# EAGLE design Dhuma (EAGLE 9.6.0)
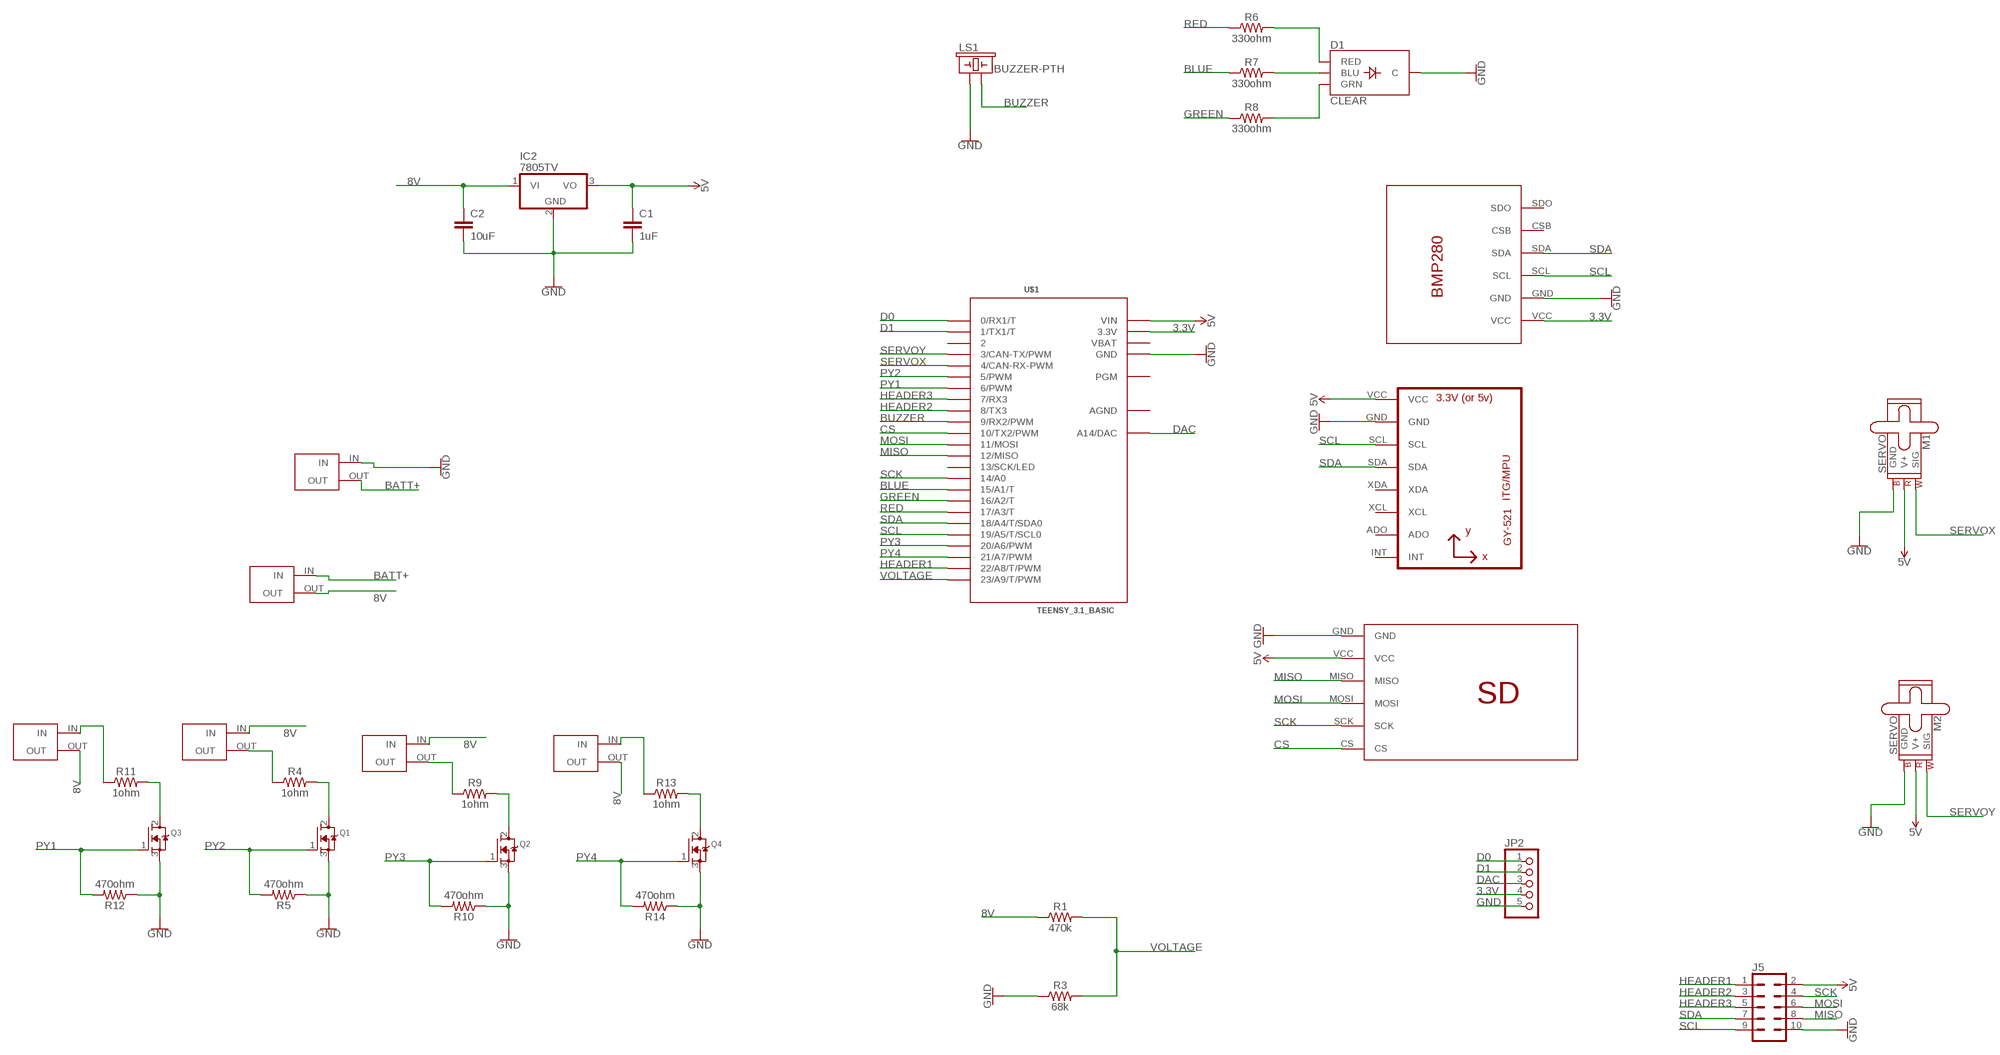
[diagram p0: schematic, sheet 1]

## Parts
C1  1uF  22PF-PTH-2.54MM-200V-5%  [CAP-PTH-2.54]
C2  10uF  22PF-PTH-2.54MM-200V-5%  [CAP-PTH-2.54]
D1  CLEAR  LED-RGB-CCCLEAR  [LED-RGB-THRU]
IC2  7805TV  [TO220V]
J5  CONN_05X2NO_SILK  [2X5_NOSILK]
JP2  PINHD-1X5  [1X05]
LS1  BUZZER-PTH  [BUZZER-12MM]
M1  SERVO  [1X03]
M2  SERVO  [1X03]
Q1  MOSFET-NGDS_TO220V  [TO220V]
Q2  MOSFET-NGDS_TO220V  [TO220V]
Q3  MOSFET-NGDS_TO220V  [TO220V]
Q4  MOSFET-NGDS_TO220V  [TO220V]
R1  470k  10OHM-HORIZ-1/4W-1%  [AXIAL-0.3]
R3  68k  10OHM-HORIZ-1/4W-1%  [AXIAL-0.3]
R4  1ohm  10OHM-HORIZ-1/4W-1%  [AXIAL-0.3]
R5  470ohm  10OHM-HORIZ-1/4W-1%  [AXIAL-0.3]
R6  330ohm  10OHM-HORIZ-1/4W-1%  [AXIAL-0.3]
R7  330ohm  10OHM-HORIZ-1/4W-1%  [AXIAL-0.3]
R8  330ohm  10OHM-HORIZ-1/4W-1%  [AXIAL-0.3]
R9  1ohm  10OHM-HORIZ-1/4W-1%  [AXIAL-0.3]
R10  470ohm  10OHM-HORIZ-1/4W-1%  [AXIAL-0.3]
R11  1ohm  10OHM-HORIZ-1/4W-1%  [AXIAL-0.3]
R12  470ohm  10OHM-HORIZ-1/4W-1%  [AXIAL-0.3]
R13  1ohm  10OHM-HORIZ-1/4W-1%  [AXIAL-0.3]
R14  470ohm  10OHM-HORIZ-1/4W-1%  [AXIAL-0.3]
U1  GY-521MPU6050  [GY-521]
U$1  TEENSY_3.1_BASIC  [TEENSY_3.1_BASIC]
U$2  BMP280  [BMP280]
U$3  SDCARD  [SDCARD]
U$4  TERMINALBLOCKUP  [TERMINALBLOCKUP]
U$5  TERMINALBLOCKUP  [TERMINALBLOCKUP]
U$6  TERMINALBLOCKUP  [TERMINALBLOCKUP]
U$7  TERMINALBLOCKUP  [TERMINALBLOCKUP]
U$8  TERMINALBLOCKUP  [TERMINALBLOCKUP]
U$9  TERMINALBLOCKUP  [TERMINALBLOCKUP]

## Nets
3.3V: JP2.4 U$1.3.3V U$1.3.3V1(3.3V) U$2.VCC
5V: C1.1 IC2.3(VO) J5.2 M1.2(V+) M2.2(V+) U1.VCC U$1.VIN U$3.VCC
8V: C2.1 IC2.1(VI) R1.P$1 U$4.IN U$5.OUT U$6.IN U$7.OUT U$9.OUT
BATT+: U$8.OUT U$9.IN
BLUE: R7.P$1 U$1.15/A1(15/A1/T)
BUZZER: LS1.- U$1.9(9/RX2/PWM)
CS: U$1.10(10/TX2/PWM) U$3.CS
D0: JP2.1 U$1.0(0/RX1/T)
D1: JP2.2 U$1.1(1/TX1/T)
DAC: JP2.3 U$1.A14(A14/DAC)
GND: C1.2 C2.2 D1.2(C) IC2.2(GND) J5.10 JP2.5 LS1.+ M1.3(GND) M2.3(GND) Q1.3(S) Q2.3(S) Q3.3(S) Q4.3(S) R3.P$1 R5.P$1 R10.P$1 R12.P$1 R14.P$1 U1.GND U$1.GND U$1.GND1(GND) U$2.GND U$3.GND U$8.IN
GREEN: R8.P$1 U$1.16/A2(16/A2/T)
HEADER1: J5.1 U$1.22/A8(22/A8/T/PWM)
HEADER2: J5.3 U$1.8(8/TX3)
HEADER3: J5.5 U$1.7(7/RX3)
MISO: J5.8 U$1.12(12/MISO) U$3.MISO
MOSI: J5.6 U$1.11(11/MOSI) U$3.MOSI
N$1: D1.1(RED) R6.P$2
N$2: D1.3(GRN) R8.P$2
N$3: D1.4(BLU) R7.P$2
N$4: Q1.2(D) R4.P$2
N$6: R11.P$1 U$5.IN
N$7: R4.P$1 U$4.OUT
N$8: Q2.2(D) R9.P$2
N$9: R13.P$1 U$7.IN
N$10: R9.P$1 U$6.OUT
N$11: Q3.2(D) R11.P$2
N$14: Q4.2(D) R13.P$2
PY1: Q3.1(G) R12.P$2 U$1.6(6/PWM)
PY2: Q1.1(G) R5.P$2 U$1.5(5/PWM)
PY3: Q2.1(G) R10.P$2 U$1.20/A6(20/A6/PWM)
PY4: Q4.1(G) R14.P$2 U$1.21/A7(21/A7/PWM)
RED: R6.P$1 U$1.17/A3(17/A3/T)
SCK: J5.4 U$1.14/A0 U$3.SCK
SCL: J5.9 U1.SCL U$1.19/A5(19/A5/T/SCL0) U$2.SCL
SDA: J5.7 U1.SDA U$1.18/A4(18/A4/T/SDA0) U$2.SDA
SERVOX: M1.1(SIG) U$1.4(4/CAN-RX-PWM)
SERVOY: M2.1(SIG) U$1.3(3/CAN-TX/PWM)
VOLTAGE: R1.P$2 R3.P$2 U$1.23/A9(23/A9/T/PWM)
Unconnected: U1.ADO U1.INT U1.XCL U1.XDA U$1.2 U$1.13(13/SCK/LED) U$1.PGM U$2.CSB U$2.SDO

## Power pins joined to a net without a drawn wire
AGND: U$1.AGND
VBAT: U$1.VBAT

## Library data of the parts
C1 C2 = SparkFun-Capacitors:22PF: 22pF ceramic capacitors A capacitor is a passive two-terminal electrical component used to store electrical energy temporarily in an electric field.; PROD_ID: CAP-09128; VALUE: 22pF
D1 = SparkFun-LED:LED-RGB-CC: LED-RGB Common Cathode Packages: LED RGB-THRU LED_PIRANHA_5MM SparkFun Products: RGB Diffused Common Cathode- Diffuse <[https://www.sparkfun.com/products/9264]> RGB Diffused Common Cathode - Clear <[https://www.sparkfun.com/products/105]> LED-RGB 5mm Square (Piranha) <[https://www.sparkfun.com/products/11679]>; PROD_ID: DIO-08418
IC2 = linear:78*: Positive VOLTAGE REGULATOR Source: http://cache.national.com/ds/LM/LM78L05.pdf http://www.fairchildsemi.com/ds/LM/LM7805.pdf
J5 = SparkFun-Connectors:CONN_05X2: Multi connection point. Often used as Generic Header-pin footprint for 0.1 inch spaced/style header connections For AVR SPI programming port, see special device with nice symbol: "AVR_SPI_PROG_5x2.dev" You can populate with any combo of single row headers, but if you'd like an exact match, check these: 2x5 AVR ICSP Male Header <https://www.sparkfun.com/products/778> (PRT-00778) 2x5 Pin Shrouded Header <https://www.sparkfun.com/products/8506> (PRT-08506) On any of the 0.1 inch spaced packages, you can populate with these: Break Away Headers - Straight <https://www.sparkfun.com/products/116> (PRT-00116) Break Away Male Headers - Right Angle <https://www.sparkfun.com/products/553> (PRT-00553) Female Headers <https://www.sparkfun.com/products/115> (PRT-00115) Break Away Headers - Machine Pin <https://www.sparkfun.com/products/117> (PRT-00117) Break Away Female Headers - Swiss Machine Pin <https://www.sparkfun.com/products/743> (PRT-00743) Special note: the shrouded connector mates well with our 5x2 ribbon cables: 2x5 Pin IDC Ribbon Cable <https://www.sparkfun.com/products/8535> (PRT-08535)
JP2 = pinhead:PINHD-1X5: PIN HEADER
LS1 = SparkFun-Electromechanical:BUZZER: Buzzer Small round buzzers that operate around the audible 2kHz range. You can use these as speakers to create simple music or user interfaces. Variant Overview: PTH - Mini Speaker - PC Mount 12mm 2.048kHz <https://www.sparkfun.com/products/7950> PTH_KIT - Mini Speaker - PC Mount 12mm 2.048kHz <https://www.sparkfun.com/products/7950> KIT simplifies soldering by adding stop mask to one side of the pads. PTH_NO_SILK - Mini Speaker - PC Mount 12mm 2.048kHz <https://www.sparkfun.com/products/7950> No silkscreen indicator of buzzer outline. PTH_KIT_NO_SILK - Mini Speaker - PC Mount 12mm 2.048kHz <https://www.sparkfun.com/products/7950> KIT package w/o silkscreen SMD - Buzzer Audio Magnetic (CCV-084B16) SMD buzzer used on, e.g. the LilyPad Buzzer <https://www.sparkfun.com/products/8463> and RFID USB Reader <https://www.sparkfun.com/products/9963>. SMD_KIT - Buzzer Audio Magnetic (CCV-084B16) SMD Buzzer with elongated pins to make soldering easier. Used on the SparkFun Simon Says - Surface Mount Soldering Kit <https://www.sparkfun.com/products/10935>.; PROD_ID: COMP-08253; SF_SKU: COM-07950
M1 M2 = SparkFun-Electromechanical:SERVO: Servo Motor 3-pin connector for a standard servo motor (voltage supply, ground, and control signal.) SparkFun Products Servo - Generic (Sub-Micro Size) <https://www.sparkfun.com/products/9065> (ROB-09065) Servo - Generic High Torque Continuous Rotation (Standard Size) <https://www.sparkfun.com/products/9347> (ROB-09347) Servo - Generic High Torque (Standard Size) <https://www.sparkfun.com/products/11965> (ROB-11965)
Q1-Q4 = adafruit:MOSFET-N: N-Channel Mosfet 2N7002E - 60V 260mA SOT23 [Digikey: 2N7002ET1GOSTR-ND] - REEL BSH103 - 30V 850mA SOT23 [Digikey: 568-5013-1-ND]
R1 R3-R14 = SparkFun-Resistors:10OHM: 10Ω resistor A resistor is a passive two-terminal electrical component that implements electrical resistance as a circuit element. Resistors act to reduce current flow, and, at the same time, act to lower voltage levels within circuits. - Wikipedia; PROD_ID: RES-12180; VALUE: 10
U1 = gy-521:GY-521
U$1 = Teensy_3_Series_Board_v1.0:TEENSY_3.1_BASIC: Footprint for Teensy 3.1 board using all pin connections on the outer perimeter
U$2 = bmp280:BMP280
U$3 = SDCARD:SDCARD
U$4-U$9 = Terminal:TERMINALBLOCKUP

## Board
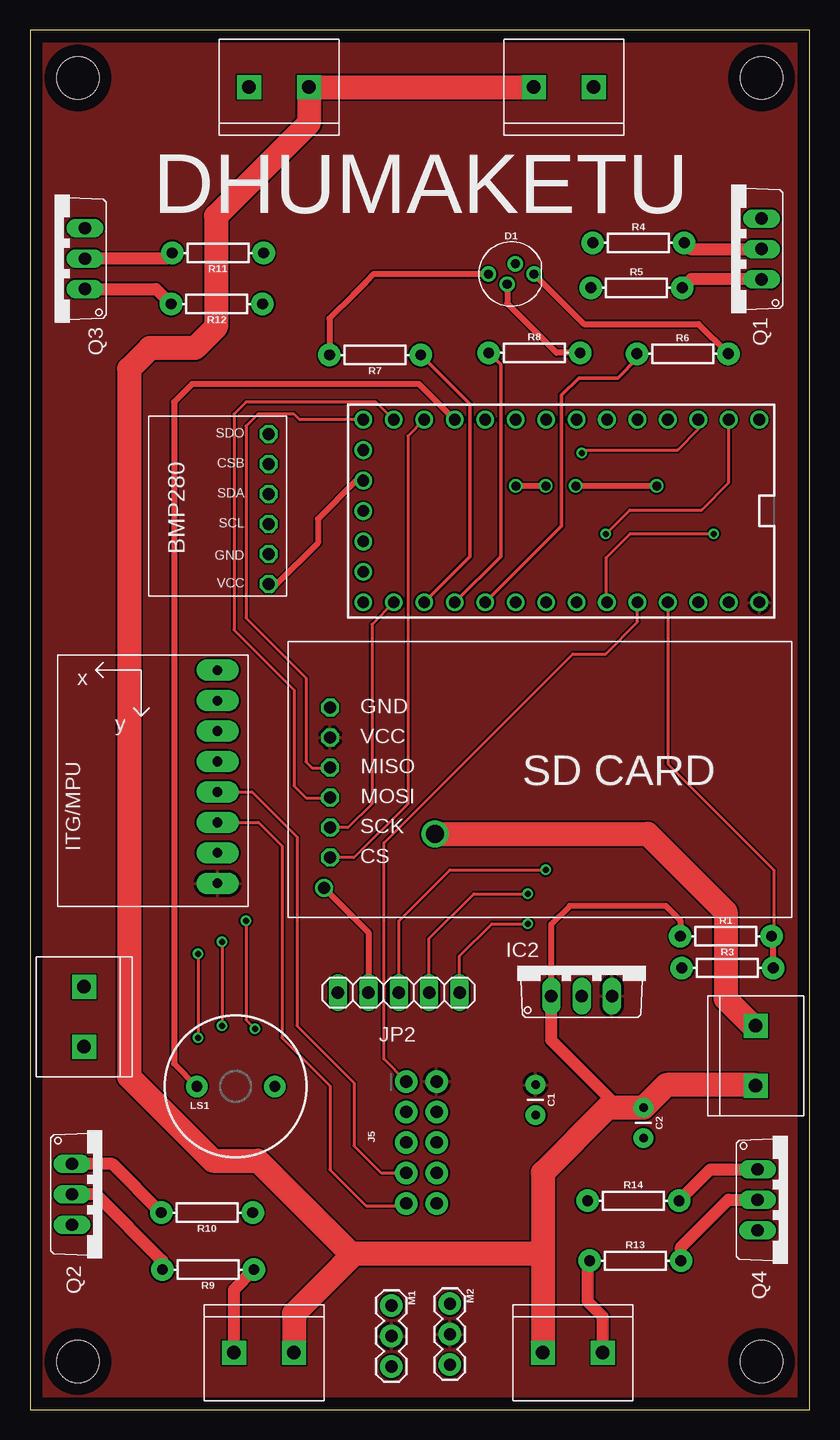
[diagram p1: board, top side]
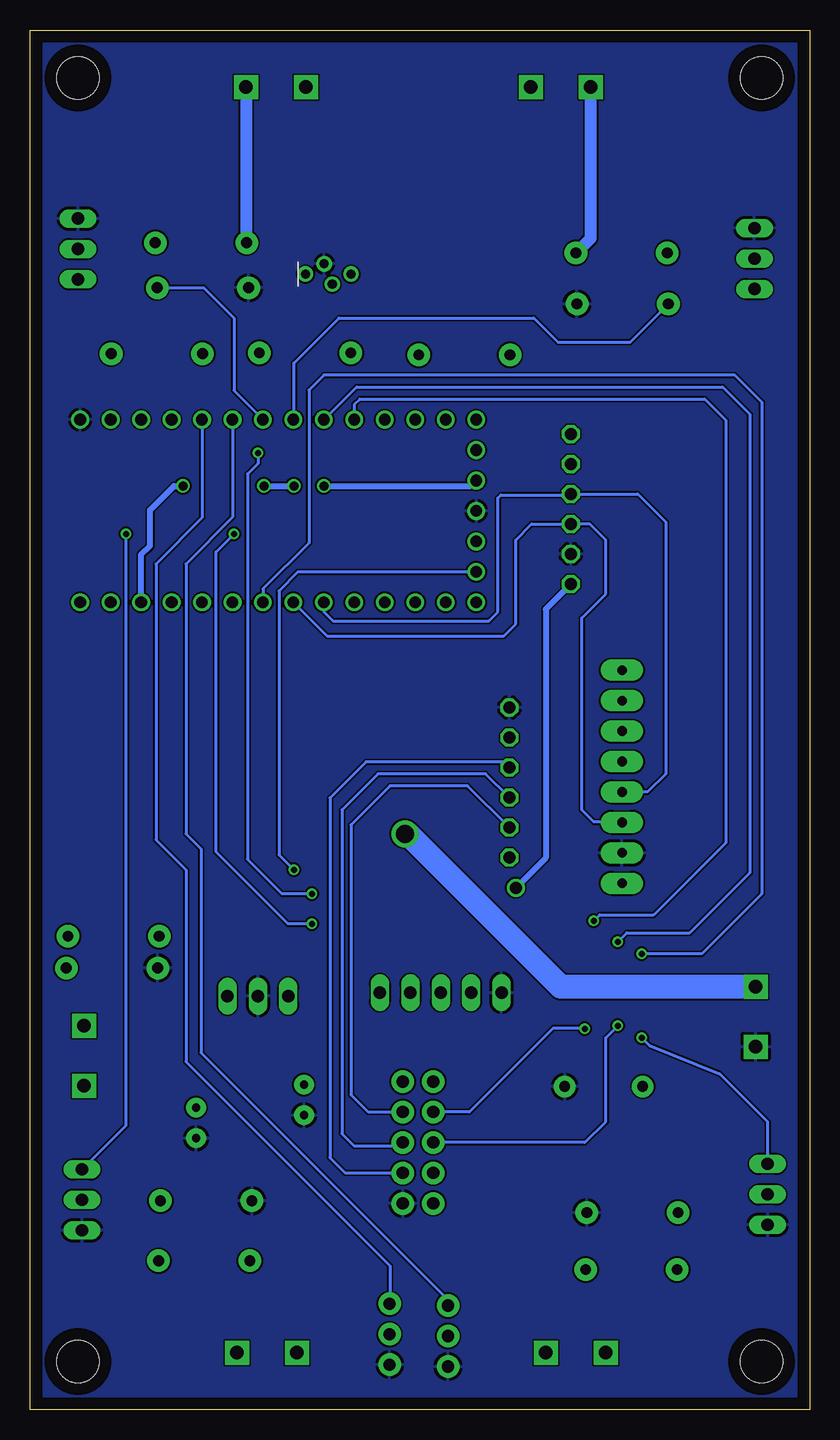
[diagram p2: board, bottom side, seen from below]

Size 65 x 115 mm. Coordinates in mm from the lower left corner, seen from the top.
Outline: 0,0 65,0 65,115 0,115 0,0
Copper layers (1*16): Top 0.035mm / dielectric 1.5mm / Bottom 0.035mm
Design rules "default": minimum track width 6mil, minimum drill 0.35mm, track to track 6mil, track to pad 6mil, pad to pad 6mil, via to via 6mil, smd to smd 6mil, copper to edge 40mil, drill to drill 6mil, minimum pad ring 10mil, minimum via ring 8mil, stop-mask expansion 4mil, vias tented up to drill 0mil, thermal gap 10mil
Holes 3.5 mm at 4,4 61,4 61,111 4,111

### Footprints (pad centres in the part's own frame; a part is rotated, then mirrored left to right if it is on the bottom)
CAP-PTH-2.54 = drill 0.7 pad 1.651: 1 -1.27,0; 2 1.27,0
LED-RGB-THRU = drill 0.762 pad 1.27: 1 1.905,0; 2 0.335,0.85; 3 -0.335,-0.85; 4 -1.905,0
TO220V = drill 1.016 long: 1 -2.54,-2.54; 2 0,-2.54; 3 2.54,-2.54
2X5_NOSILK = drill 1.016 pad 1.88: 1 0,0; 2 0,2.54; 3 2.54,0; 4 2.54,2.54; 5 5.08,0; 6 5.08,2.54; 7 7.62,0; 8 7.62,2.54; 9 10.16,0; 10 10.16,2.54
1X05 = drill 1.016 long: 1 -5.08,0; 2 -2.54,0; 3 0,0; 4 2.54,0; 5 5.08,0
BUZZER-12MM = drill 0.9 pad 1.778: + 3.25,0; - -3.25,0
1X03 = drill 1.016 pad 1.88: 1 0,0; 2 2.54,0; 3 5.08,0
AXIAL-0.3 = drill 0.9 pad 1.88: P$1 -3.81,0; P$2 3.81,0
GY-521 = drill 0.8 pad 1.778 long: ADO -8.89,-6.35; GND -8.89,6.35; INT -8.89,-8.89; SCL -8.89,3.81; SDA -8.89,1.27; VCC -8.89,8.89; XCL -8.89,-3.81; XDA -8.89,-1.27
TEENSY_3.1_BASIC = drill 0.965: 0 -7.62,13.97; 1 -7.62,11.43; 2 -7.62,8.89; 3 -7.62,6.35; 3.3V 7.62,11.43; 3.3V1 -2.54,-16.51; 4 -7.62,3.81; 5 -7.62,1.27; 6 -7.62,-1.27; 7 -7.62,-3.81; 8 -7.62,-6.35; 9 -7.62,-8.89; 10 -7.62,-11.43; 11 -7.62,-13.97; 12 -7.62,-16.51; 13 7.62,-16.51; 14/A0 7.62,-13.97; 15/A1 7.62,-11.43; 16/A2 7.62,-8.89; 17/A3 7.62,-6.35; 18/A4 7.62,-3.81; 19/A5 7.62,-1.27; 20/A6 7.62,1.27; 21/A7 7.62,3.81; 22/A8 7.62,6.35; 23/A9 7.62,8.89; A14 5.08,-16.51; AGND 7.62,13.97; GND -7.62,16.51; GND1 0,-16.51; PGM 2.54,-16.51; VBAT -5.08,-16.51; VIN 7.62,16.51
BMP280 = drill 1 octagon: CSB 11,1.5; GND 3.5,1.5; SCL 6,1.5; SDA 8.5,1.5; SDO 13.5,1.5; VCC 1,1.5
SDCARD = drill 1 octagon: CS 3.5,5; GND 3.5,17.5; MISO 3.5,12.5; MOSI 3.5,10; SCK 3.5,7.5; VCC 3.5,15
TERMINALBLOCKUP = drill 1.1 pad 2 square: IN 2.5,4; OUT 7.5,4

### Placement (x,y rotation side)
C1  42.15,25.81 270 top
C2  51.15,23.89 270 top
D1  40.13,94.66 0 top
IC2  46,37 0 top
J5  31.37,27.34 270 top
JP2  30.75,34.75 180 top
LS1  17.16,26.93 0 top
M1  30.14,8.66 270 top
M2  35.01,8.82 270 top
Q1  58.46,96.75 90 top
Q2  6.04,17.93 270 top
Q3  2.05,95.95 90 top
Q4  63.2,17.48 270 top
R1  58.03,39.45 0 top
R3  58.16,36.81 0 top
R4  50.74,97.26 0 top
R5  50.58,93.51 0 top
R6  54.42,88.01 0 top
R7  28.78,87.91 180 top
R8  42.06,88.09 0 top
R9  14.85,11.66 180 top
R10  14.76,16.41 180 top
R11  15.67,96.41 180 top
R12  15.58,92.16 180 top
R13  50.47,12.4 0 top
R14  50.31,17.4 0 top
U1  6.75,52.75 180 top
U$1  44.3,74.9 270 top
U$2  21.4,67.82 90 top
U$3  21.53,41.02 0 top
U$4  39.5,106.25 0 top
U$5  15.75,106.25 0 top
U$6  24.5,8.75 180 top
U$7  50.25,8.75 180 top
U$8  8.5,27.75 90 top
U$9  56.5,34.5 270 top

### Tracks (layer width: path | path; a pad name or v marks a point on that pad's centre or on a via)
3.3V  (via drill 0.75, 1)
  Top 0.5: U$1.3.3V1 27.19,77.44 24,74.25 24,72.25 20.57,68.82 U$2.VCC | v52.25,77 v45.5,77 | v43,77 v40.5,77 | v24.5,43.5 28.21,39.79 JP2.4
  Bottom 0.5: U$2.VCC 22,66.72 22,46 v24.5,43.5 | U$1.3.3V 55.73,71.27 55,72 55,75 53,77 v52.25,77 | v45.5,77 v43,77 | v40.5,77 28.23,77 U$1.3.3V1
5V
  pour Top: -2,117 67,117 67,-2 -2,-2
8V
  Top 0.5: IC2.1 43.46,40.46 45,42 53,42 54.22,40.78 R1.P$1
  Top 1: C2.1 49.09,25.16 43.46,30.79 IC2.1
  Top 2: U$9.OUT 60.44,27.06 53.05,27.06 C2.1 48.16,25.16 42.75,19.75 42.75,13 | 42.75,13 U$7.OUT | U$4.IN U$5.OUT 23.25,107.25 15.5,99.5 15.5,90.25 13.75,88.5 10,88.5 8.25,86.75 8.25,27.75 15.25,20.75 19,20.75 26.88,12.88 | 42.75,13 27,13 26.88,12.88 | 26.88,12.88 26,12 22,8 U$6.IN
BATT+  (via drill 1.5)
  Top 2: v33.75,48 51.5,48 58,41.5 58,34.25 60.25,32 U$9.IN
  Bottom 2: U$8.OUT 20.75,35.25 33.5,48 v33.75,48
BLUE
  Top 0.3: R7.P$1 36.7,83.8 36.7,71.11 U$1.15/A1
BUZZER
  Top 0.5: U$1.9 32.43,85.5 13.5,85.5 12,84 12,28.84 LS1.-
CS
  Top 0.25: U$1.10 31.5,81.15 31.5,50.5 27.02,46.02 U$3.CS
D0  (via drill 0.5)
  Top 0.25: JP2.1 35.83,37.83 38.5,40.5 v41.5,40.5 | v48,73 50,75 56,75 58.27,77.27 U$1.0
  Bottom 0.25: v41.5,40.5 43.5,40.5 49.5,46.5 49.5,71.5 v48,73
D1  (via drill 0.5)
  Top 0.25: JP2.2 33.29,39.29 37,43 v41.5,43 | U$1.1 55.73,81.73 54,80 46.25,80 v46,79.75
  Bottom 0.25: v41.5,43 44,43 46.86,45.86 46.86,78 46,78.86 v46,79.75
DAC  (via drill 0.5)
  Top 0.25: JP2.3 30.75,40.75 35,45 v43,45
  Bottom 0.25: U$1.A14 42.68,69.82 44.25,68.25 44.25,46.25 v43,45
GND
  pour Bottom: -2,116 67,116 67,-2 -2,-2 -3,-3 -3,115
GREEN
  Top 0.3: U$1.16/A2 39.25,71.12 39.25,87.09 R8.P$1
HEADER1
  Top 0.25: J5.1 29.5,29.21 29.5,47.25 45.25,63 48,63 50.65,65.65 U$1.22/A8
HEADER2  (via drill 0.5)
  Top 0.25: v18,40.75 18,32.5 v18.75,31.75
  Bottom 0.25: U$1.8 37.95,83.8 37.5,84.25 8.75,84.25 7,82.5 7,47.25 13,41.25 17.5,41.25 v18,40.75 | v18.75,31.75 18.75,31.78 18.73,31.8 21.37,31.8 28.37,24.8 J5.3
HEADER3  (via drill 0.5)
  Top 0.25: v16,39 v16,32
  Bottom 0.25: U$1.7 37.76,85.25 7.25,85.25 5,83 5,44.75 10,39.75 15.25,39.75 v16,39 | J5.5 18.74,22.26 17,24 17,31 v16,32
MISO
  Top 0.25: U$1.12 22.48,82.52 22,83 19,83 18,82 18,66 23,61 23,54 23.5,53.5 25.01,53.5 U$3.MISO
  Bottom 0.25: U$3.MISO 25.51,54 37,54 40,51 40,21 38.72,19.72 J5.8
MOSI
  Top 0.25: U$3.MOSI 25.01,51 23,51 22,52 22,60 17,65 17,83 18,84 28.85,84 U$1.11
  Bottom 0.25: U$3.MOSI 27.01,53 36,53 39,50 39,23 38,22 34.17,22 J5.6
N$1
  Top 0.5: D1.1 46.2,90.5 55.74,90.5 R6.P$2
N$2
  Top 0.5: R8.P$2 43.91,88.09 39.8,92.2 D1.3
N$3
  Top 0.5: D1.4 28.66,94.66 28,94 27,93 24.97,90.97 R7.P$2
N$4
  Top 1: R4.P$2 55.06,96.75 Q1.2
N$6
  Bottom 1: U$5.IN 18.25,97.64 R11.P$1
N$7
  Bottom 1: U$4.OUT 47,97.33 R4.P$1
N$8
  Top 1: R9.P$2 11.04,12.41 5.52,17.93 Q2.2
N$9
  Top 1: R13.P$1 46.5,12.24 46.5,9 47.75,7.75 U$7.IN
N$10
  Top 1: U$6.OUT 17,10 R9.P$1
N$11
  Top 1: R11.P$2 11.4,95.95 Q3.2
N$14
  Top 1: R13.P$2 54.28,13.53 58.23,17.48 Q4.2
PY1
  Top 1: Q3.1 10.52,93.41 R12.P$2
  Bottom 0.25: U$1.6 43,82.55 43,87.25 39.25,91 23,91 21,89 14.93,89 R12.P$2
PY2
  Top 1: Q1.1 60.96,94.25 55.13,94.25 R5.P$2
  Bottom 0.25: R5.P$2 50.51,93.51 48,91 48,84.95 U$1.5
PY3  (via drill 0.5)
  Top 0.25: v14,38 v14,31
  Top 1: R10.P$2 6.89,20.47 Q2.1
  Bottom 0.25: Q2.1 3.5,24 7.5,28 13.33,30.33 v14,31 | U$1.20/A6 45.57,68.43 41.75,72.25 41.75,85 40.5,86.25 6.25,86.25 4,84 4,43 9,38 v14,38
PY4  (via drill 0.5)
  Top 0.25: U$1.21/A7 48,67.39 48,71 50,73 v57,73
  Top 1: R14.P$2 56.74,20.02 Q4.1
  Bottom 0.25: Q4.1 57,23.68 v57,73
RED
  Top 0.3: U$1.17/A3 44.3,73.63 44.3,84.55 45.75,86 49,86 50.61,87.61 R6.P$1
SCK
  Top 0.25: U$1.14/A0 28.5,65.45 28.5,50.5 26.52,48.52 U$3.SCK
  Bottom 0.25: U$3.SCK 28.51,52 35,52 38.25,48.75 38.25,26.25 36.8,24.8 J5.4
SCL
  Top 0.25: U1.SCL 19.06,48.94 21,47 21,31 25,27 25,20 28,17 31.19,17 J5.9
  Bottom 0.25: U$1.19/A5 40.25,64.5 25.5,64.5 24.5,65.5 24.5,72.5 23.18,73.82 U$2.SCL 18.32,73.82 17,72.5 17,68 19,66 19,50 18,49 15.7,49 U1.SCL
SDA
  Top 0.25: U1.SDA 18.52,51.48 22.25,47.75 22.25,32 27,27.25 27,22 29.28,19.72 J5.7
  Bottom 0.25: U1.SDA 13.52,51.48 12,53 12,74 14.32,76.32 U$2.SDA 19.97,76.25 25.75,76.25 26,76 26,66.5 26.75,65.75 39.75,65.75 40.49,66.49 U$1.18/A4
SERVOX
  Bottom 0.25: U$1.4 48.11,74.39 52,70.5 52,48 50.75,46.75 50.75,29.75 30.14,9.14 M1.1
SERVOY
  Bottom 0.25: U$1.3 50.65,74.35 54.5,70.5 54.5,47.5 52,45 52,29 35,12 M2.1
VOLTAGE
  Top 0.25: U$1.23/A9 53.19,53.81 62,45 62,39.61 R1.P$2
  Top 0.5: R3.P$2 61.97,39.58 62,39.61

### Text on the board
tNames: DHUMAKETU